# Altium schematic sheet Main.SchDoc
size A4
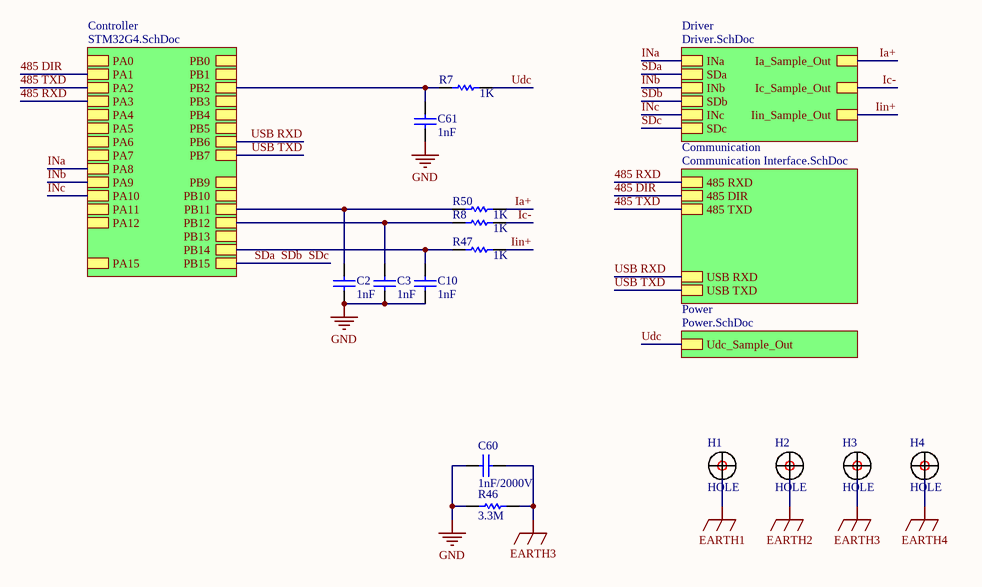
[diagram p0: Main.SchDoc]

## Parts
C2  1nF  [C0402]
C3  1nF  [C0402]
C10  1nF  [C0402]
C60  1nF/2000V  [C1206]
C61  1nF  [C0402]
H1  HOLE  [定位孔 Φ3 1]
H2  HOLE  [定位孔 Φ3 1]
H3  HOLE  [定位孔 Φ3 1]
H4  HOLE  [定位孔 Φ3 1]
R7  1K  [R0402]
R8  1K  [R0402]
R46  3.3M  [R1206]
R47  1K  [R0402]
R50  1K  [R0402]

## Sub-sheets
Communication = Communication Interface.SchDoc: 485 RXD, 485 DIR, 485 TXD, USB RXD, USB TXD
Controller = STM32G4.SchDoc: PA1, PA2, PA3, PA4, PA5, PA6, PA7, PA8, PA9, PA10, PA11, PA12, PA15, PB1, PB2, PB3, PB4, PB5, PB6, PB7, PB9, PB10, PB11, PB12, PB13, PB14, PB15, PA0, PB0
Driver = Driver.SchDoc: INa, SDa, Ia_Sample_Out, Ic_Sample_Out, INb, SDb, INc, SDc, Iin_Sample_Out
Power = Power.SchDoc: Udc_Sample_Out

## Nets
EARTH1: H1.1
EARTH2: H2.1
EARTH3: C60.2 H3.1 R46.1
EARTH4: H4.1
GND: C2.2 C3.2 C10.2 C60.1 C61.2 R46.2
485 DIR: sheet Controller/PA1, sheet Communication/485 DIR
485 RXD: sheet Controller/PA3, sheet Communication/485 RXD
485 TXD: sheet Controller/PA2, sheet Communication/485 TXD
Ia+: R50.1 ; sheet Driver/Ia_Sample_Out
Ic-: R8.1 ; sheet Driver/Ic_Sample_Out
Iin+: R47.1 ; sheet Driver/Iin_Sample_Out
INa: sheet Controller/PA8, sheet Driver/INa
INb: sheet Controller/PA9, sheet Driver/INb
INc: sheet Controller/PA10, sheet Driver/INc
SDa: sheet Controller/PB15, sheet Driver/SDa, sheet Driver/SDb, sheet Driver/SDc  [also labelled SDb, SDc]
Udc: R7.1 ; sheet Power/Udc_Sample_Out
USB RXD: sheet Controller/PB6, sheet Communication/USB RXD
USB TXD: sheet Controller/PB7, sheet Communication/USB TXD
NetC2_1: C2.1 R50.2 ; sheet Controller/PB11
NetC3_1: C3.1 R8.2 ; sheet Controller/PB12
NetC10_1: C10.1 R47.2 ; sheet Controller/PB14
NetC61_1: C61.1 R7.2 ; sheet Controller/PB2

## Library data of the parts
C2 C3 C10 C60 C61 = Cap
R7 R8 R46 R47 R50 = RES